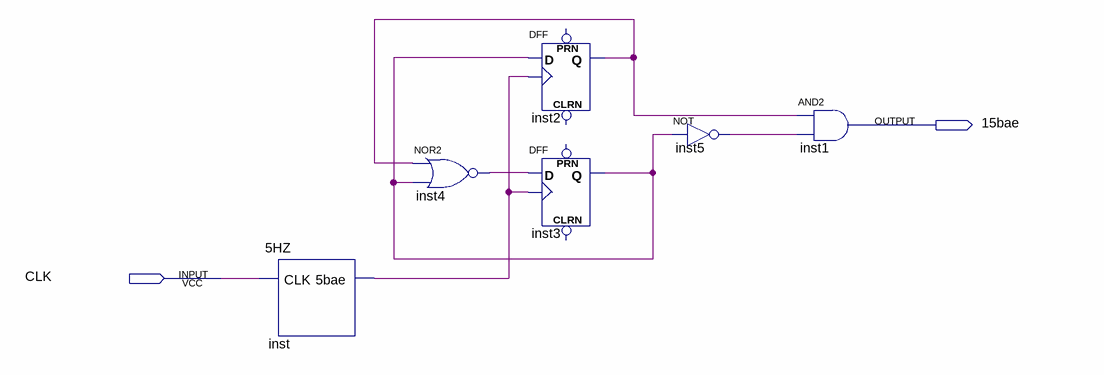
[diagram p0: schematic sheet]
// Quartus schematic 15HZ.bdf as structural Verilog: 6 symbols, 2 pins
module \15HZ  (
  input  CLK,
  output \15bae 
);

  wire inst2_q, inst3_q, inst4_out, inst5_out, inst_5bae;

  \5HZ  inst (.CLK(CLK), .\5bae (inst_5bae));
  nor inst4 (inst4_out, inst2_q, inst3_q);
  DFF inst2 (.CLK(inst_5bae), .D(inst3_q), .Q(inst2_q));  // open: CLRN, PRN
  DFF inst3 (.CLK(inst_5bae), .D(inst4_out), .Q(inst3_q));  // open: CLRN, PRN
  not inst5 (inst5_out, inst3_q);
  and inst1 (\15bae , inst2_q, inst5_out);
endmodule
